# EAGLE design pcb-jetson (EAGLE 9.6.2)
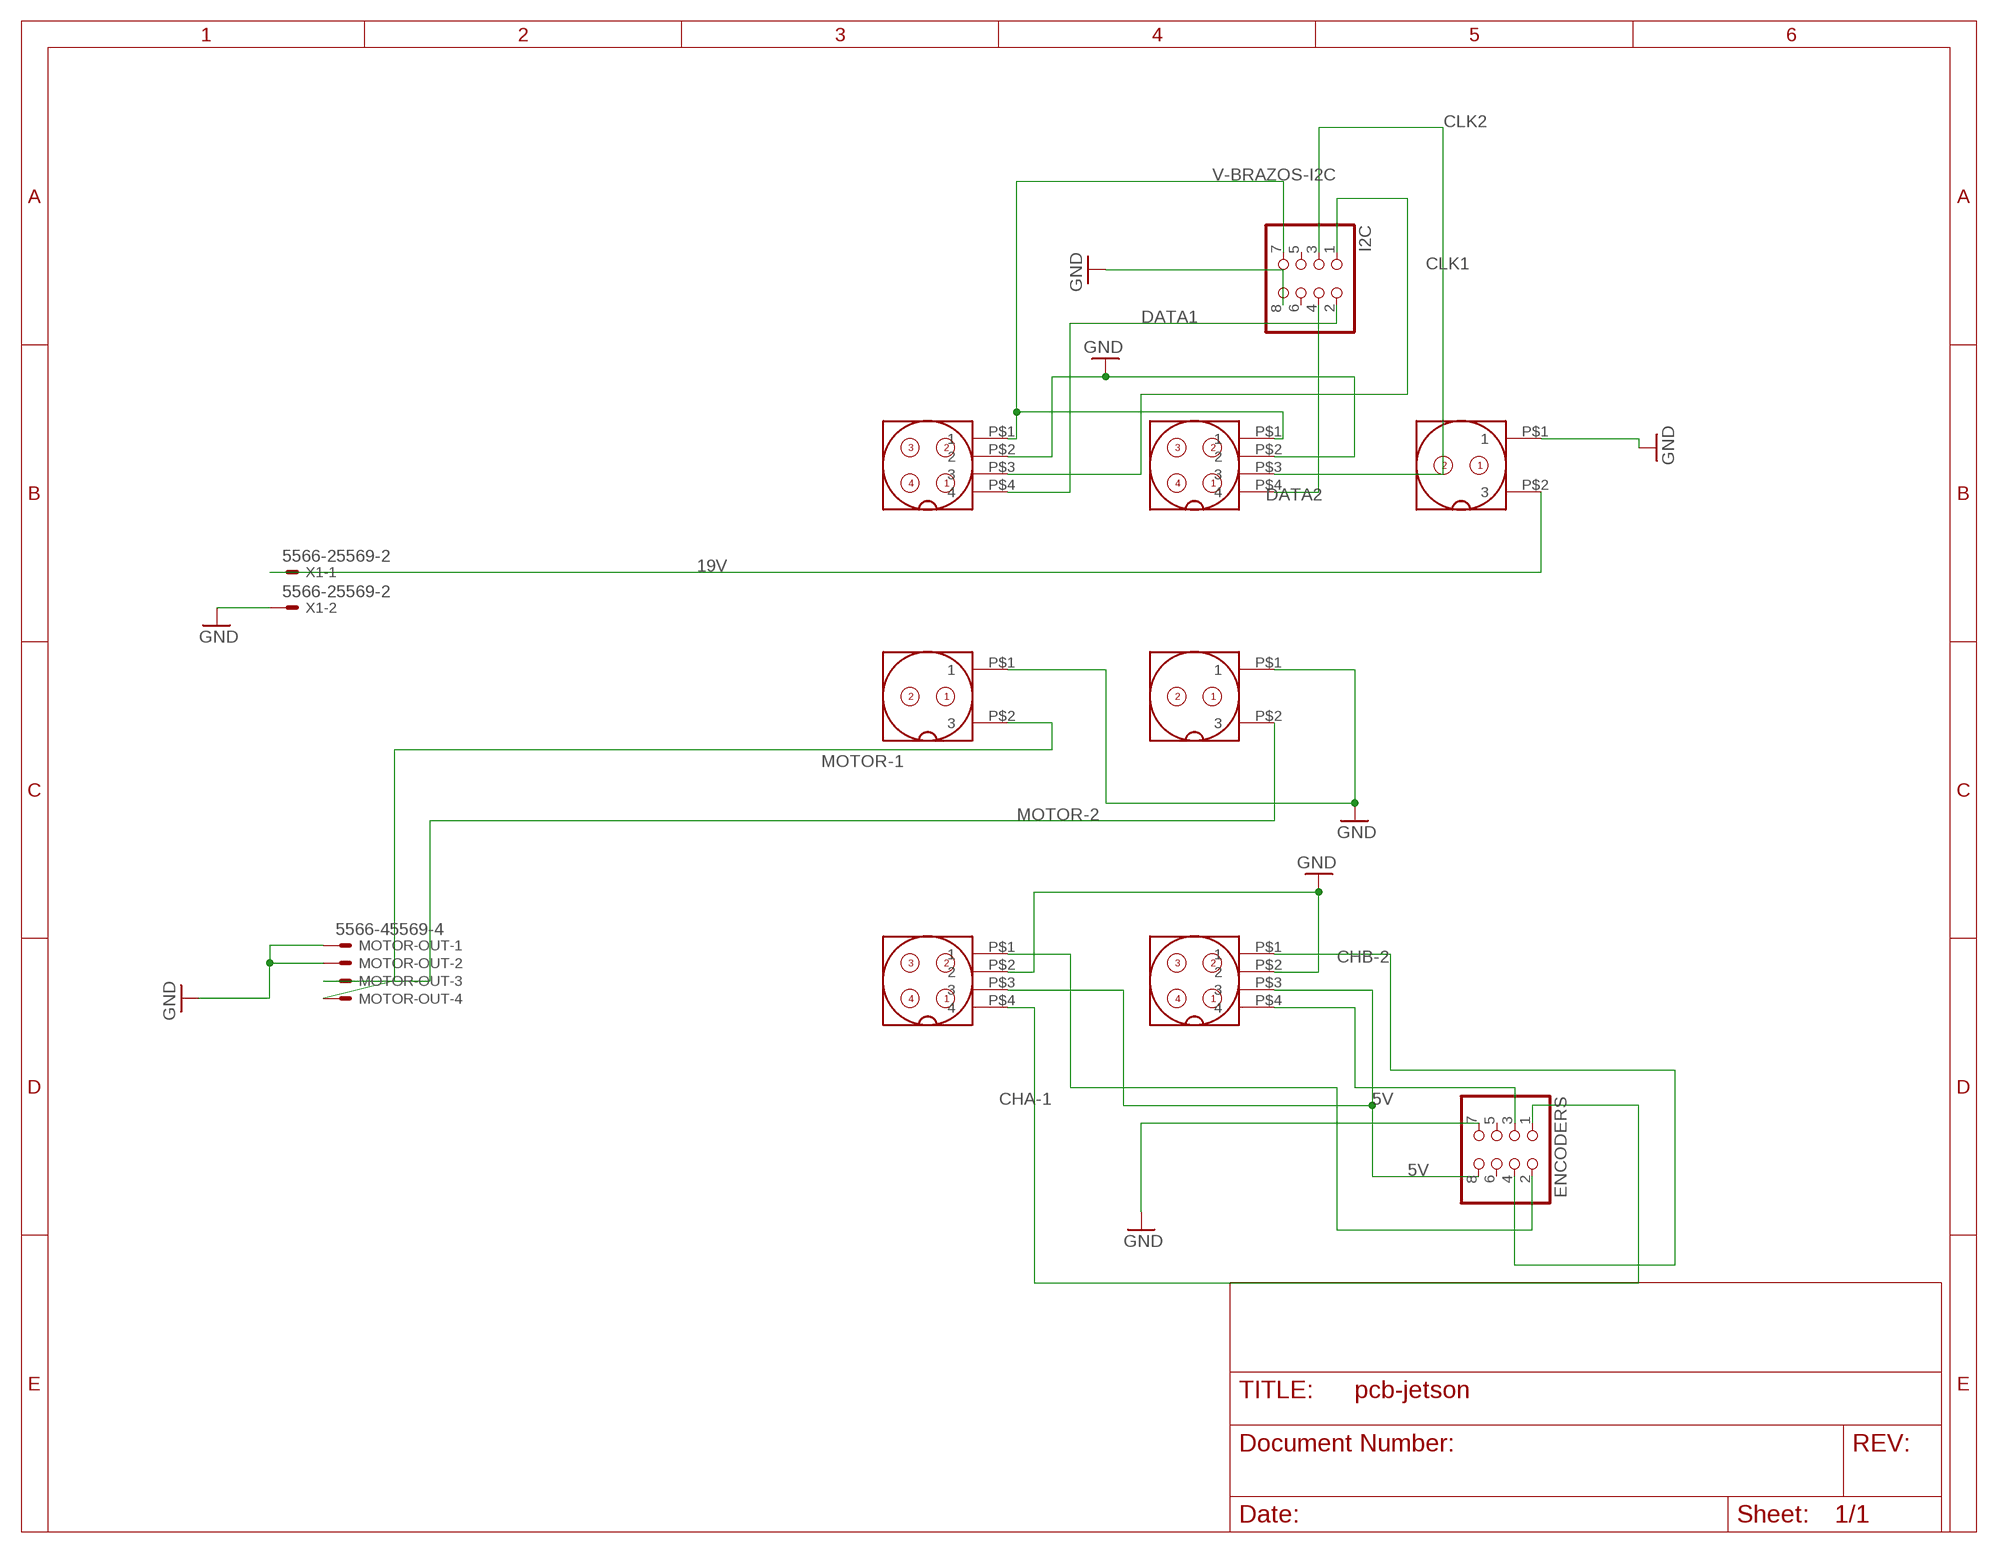
[diagram p0: schematic, sheet 1]

## Parts
BRAZO-I2C-2  GX16_4_PINS  [GX16_4_PINS_PADS]
BRAZO_I2C-1  GX16_4_PINS  [GX16_4_PINS_PADS]
ENCODERS  PINHD-2X4  [2X04]
I2C  PINHD-2X4  [2X04]
JETSONIN  GX16_2_PINS  [GX16_2_PINS_PADS]
MOTOR1  GX16_2_PINS  [GX16_2_PINS_PADS]
MOTOR2  GX16_2_PINS  [GX16_2_PINS_PADS]
MOTOR-OUT  5566-45569-4  [5569-4]
U$3  GX16_4_PINS  [GX16_4_PINS_PADS]
U$4  GX16_4_PINS  [GX16_4_PINS_PADS]
X1  5566-25569-2  [5569-2]

## Nets
5V: ENCODERS.8 U$3.P$3 U$4.P$3
19V: JETSONIN.P$2 X1.1
CHA-1: ENCODERS.1 U$3.P$4
CHA-2: ENCODERS.3 U$4.P$4
CHB-1: ENCODERS.2 U$3.P$1
CHB-2: ENCODERS.4 U$4.P$1
CLK1: BRAZO_I2C-1.P$3 I2C.1
CLK2: BRAZO-I2C-2.P$3 I2C.3
DATA1: BRAZO_I2C-1.P$4 I2C.2
DATA2: BRAZO-I2C-2.P$4 I2C.4
GND: BRAZO-I2C-2.P$2 BRAZO_I2C-1.P$2 ENCODERS.7 I2C.8 JETSONIN.P$1 MOTOR1.P$1 MOTOR2.P$1 MOTOR-OUT.1 MOTOR-OUT.2 U$3.P$2 U$4.P$2 X1.2
MOTOR-1: MOTOR1.P$2 MOTOR-OUT.4
MOTOR-2: MOTOR2.P$2 MOTOR-OUT.3
V-BRAZOS-I2C: BRAZO-I2C-2.P$1 BRAZO_I2C-1.P$1 I2C.7
Unconnected: ENCODERS.5 ENCODERS.6 I2C.5 I2C.6

## Library data of the parts
BRAZO-I2C-2 BRAZO_I2C-1 U$3 U$4 = Robocol_Eagle_Libraries:GX16_4_PINS: GX19 Reference: GX19 4 pins Type: Male Connector. Description: Aviation connector use for power connections. Rated Current: 7A Maximum working Voltage: 250 V AC RMS Author: Franz Luepke. Year: 2020 Made for use in: Robocol Uniandes.
ENCODERS I2C = pinhead:PINHD-2X4: PIN HEADER
JETSONIN MOTOR1 MOTOR2 = Robocol_Eagle_Libraries:GX16_2_PINS: GX19 Reference: GX19 2 pins Type: Male Connector. Description: Aviation connector use for power connections. Rated Current: 7A Maximum working Voltage: 250 V AC RMS Author: Franz Luepke. Year: 2020 Made for use in: Robocol Uniandes.
MOTOR-OUT = con-molex-2:5566-4: Mini FIT connector 4 pol Source: http://www.molex.com
X1 = con-molex-2:5566-2: Mini FIT connector 2 pol Source: http://www.molex.com

## Board
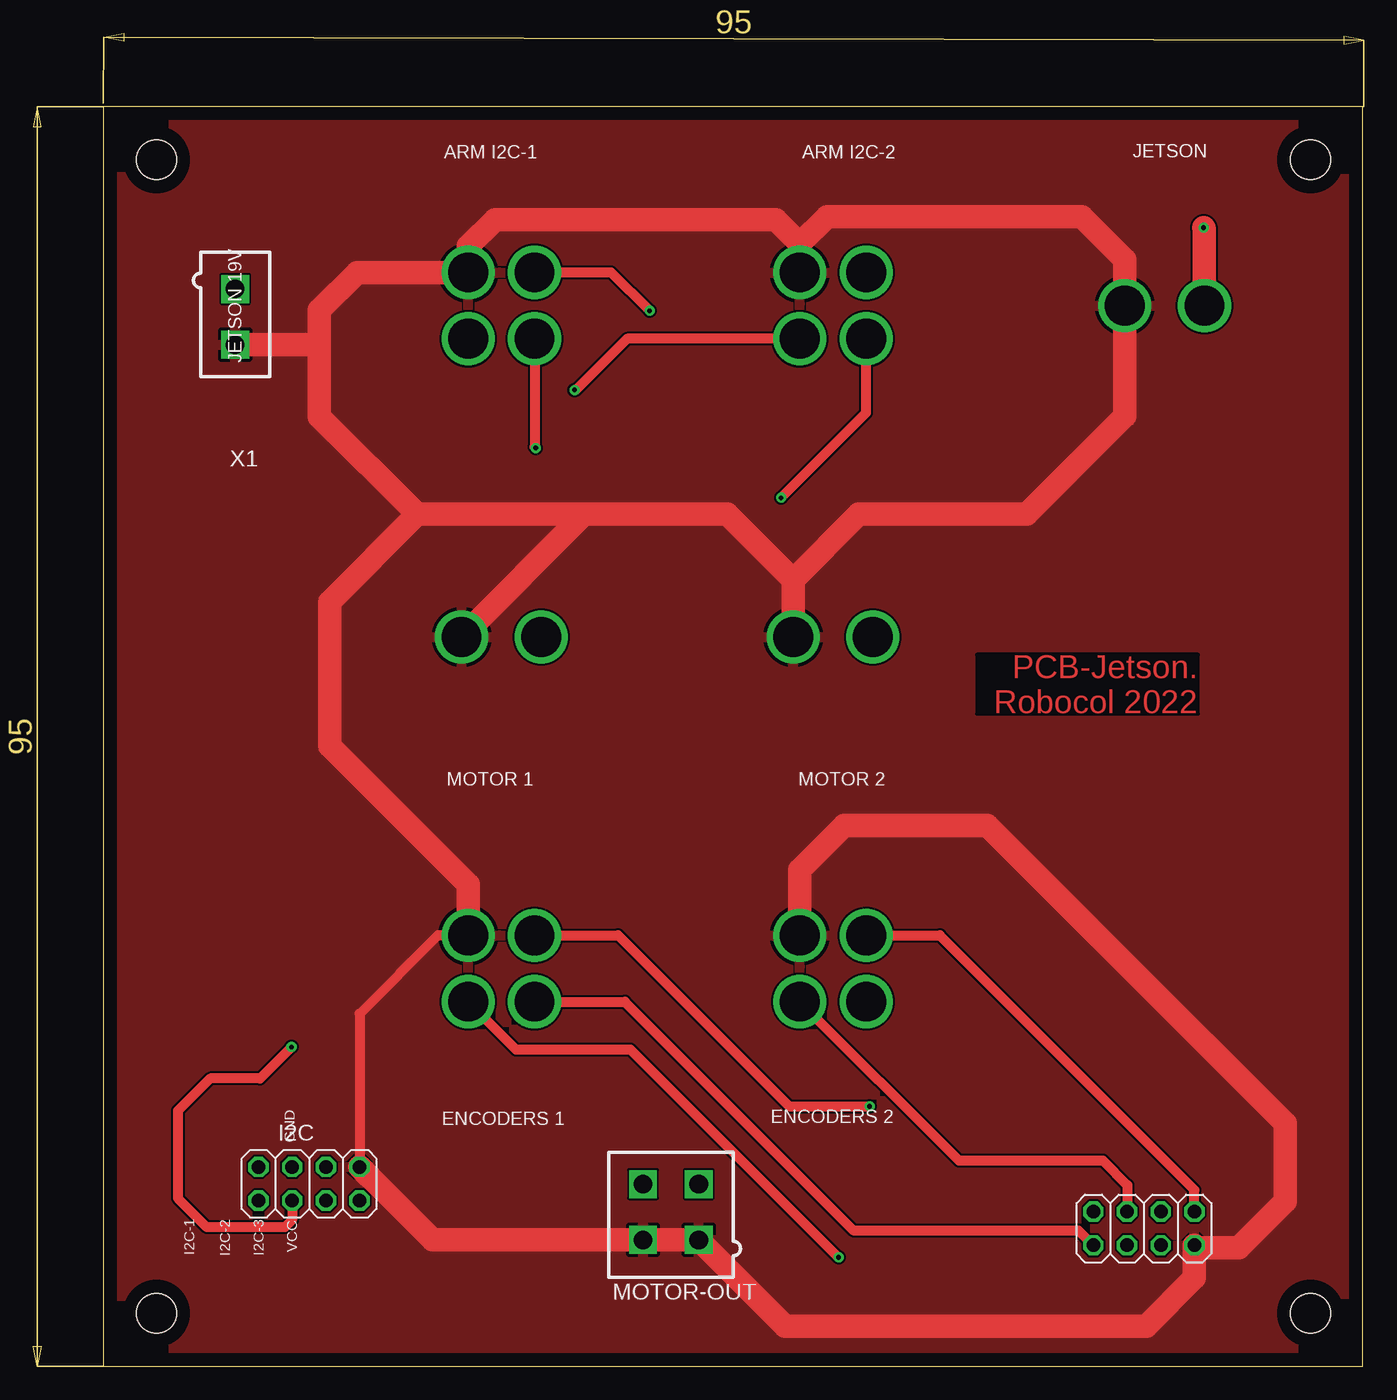
[diagram p1: board, top side]
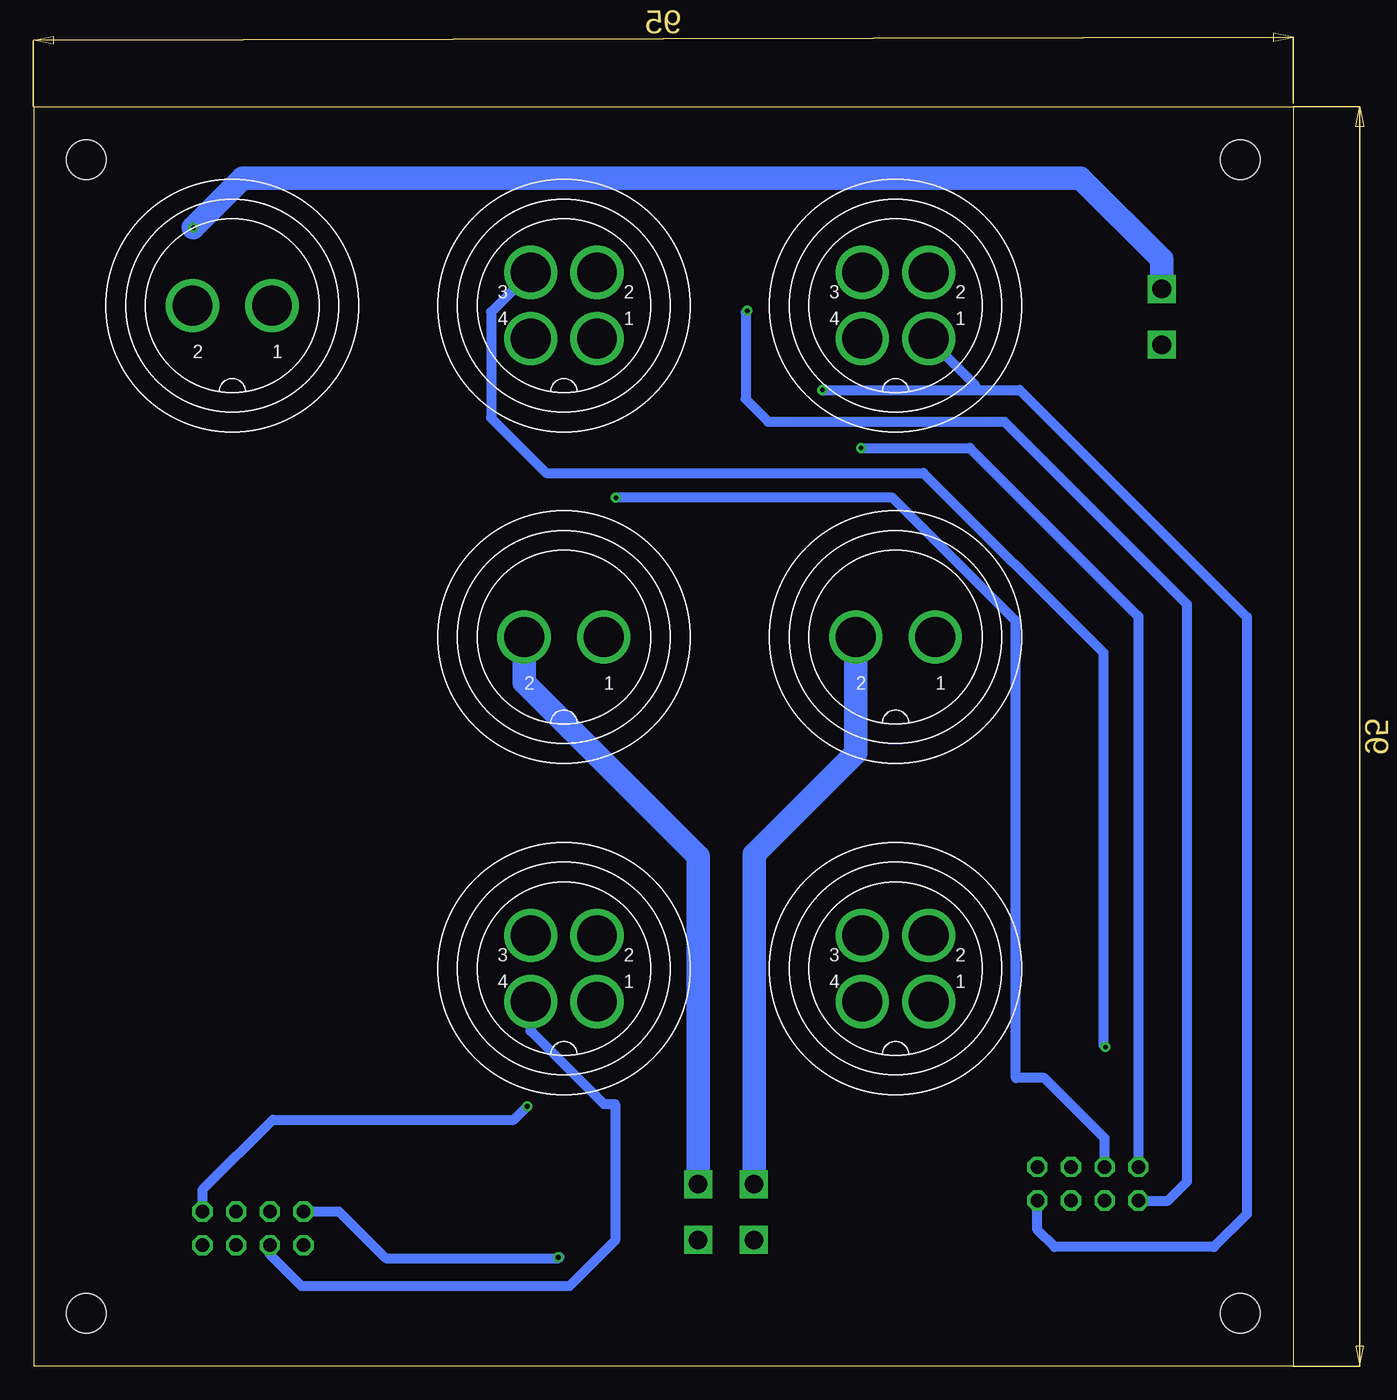
[diagram p2: board, bottom side, seen from below]

Size 94.93 x 95 mm. Coordinates in mm from the lower left corner, seen from the top.
Outline: 0,0 94.93,0 94.93,95 0,95 0,0
Copper layers (1*16): Top 0.035mm / dielectric 1.5mm / Bottom 0.035mm
Design rules "default": minimum track width 6mil, minimum drill 0.35mm, track to track 6mil, track to pad 6mil, pad to pad 6mil, via to via 6mil, smd to smd 6mil, copper to edge 40mil, drill to drill 6mil, minimum pad ring 10mil, minimum via ring 8mil, stop-mask expansion 4mil, vias tented up to drill 0mil, thermal gap 10mil
Holes 3 mm at 4,91 91,91 91,4 4,4

### Footprints (pad centres in the part's own frame; a part is rotated, then mirrored left to right if it is on the bottom)
GX16_4_PINS_PADS = drill 3 pad 4: P$1 2.5,-2.5; P$2 2.5,2.5; P$3 -2.5,2.5; P$4 -2.5,-2.5
2X04 = drill 1.016 octagon: 1 -3.81,-1.27; 2 -3.81,1.27; 3 -1.27,-1.27; 4 -1.27,1.27; 5 1.27,-1.27; 6 1.27,1.27; 7 3.81,-1.27; 8 3.81,1.27
GX16_2_PINS_PADS = drill 3 pad 4: P$1 3,0; P$2 -3,0
5569-4 = drill 1.4 square: 1 2.1,-2.1; 2 -2.1,-2.1; 3 2.1,2.1; 4 -2.1,2.1
5569-2 = drill 1.4 square: 1 0,-2.1; 2 0,2.1

### Placement (x,y rotation side)
BRAZO-I2C-2  55,80 0 bottom
BRAZO_I2C-1  30,80 0 bottom
ENCODERS  78.44,10.4 0 top
I2C  15.5,13.77 0 top
JETSONIN  80,80 0 bottom
MOTOR1  30,55 0 bottom
MOTOR2  55,55 0 bottom
MOTOR-OUT  42.78,11.63 0 top
U$3  30,30 0 bottom
U$4  55,30 0 bottom
X1  9.93,79.15 180 top

### Tracks (layer width: path | path; a pad name or v marks a point on that pad's centre or on a via)
5V  (via drill 0.35)
  Top 0.762: U$3.P$3 38.8,32.5 51.69,19.61 v57.76,19.61 | U$4.P$3 63.06,32.5 82.25,13.31 ENCODERS.8
  Bottom 0.762: ENCODERS.8 82.25,13.31 76.95,18.61 58.76,18.61 v57.76,19.61
19V  (via drill 0.35)
  Top 1.778: v82.94,85.88 83,85.81 JETSONIN.P$2
  Bottom 1.778: v82.94,85.88 79.2,89.61 16.06,89.61 9.93,83.49 X1.1
CHA-1
  Top 0.762: U$3.P$4 39.31,27.5 56.57,10.24 73.52,10.24 ENCODERS.1
CHA-2
  Bottom 0.762: U$4.P$4 57.5,25.29 51.97,19.76 51.13,19.76 51.13,9.5 54.59,6.04 74.77,6.04 77.17,8.44 ENCODERS.3
CHB-1  (via drill 0.35)
  Top 0.762: U$3.P$1 31.1,23.9 39.73,23.9 55.4,8.23 v55.43,8.23
  Bottom 0.762: v55.43,8.23 55.33,8.23 55.4,8.15 68.43,8.15 71.95,11.67 ENCODERS.2
CHB-2
  Top 0.762: U$4.P$1 64.48,15.52 75.34,15.52 77.19,13.66 77.19,11.69 ENCODERS.4
CLK1  (via drill 0.35)
  Top 0.762: v41.18,79.6 38.28,82.5 BRAZO_I2C-1.P$3
  Bottom 0.762: I2C.1 9.46,12.5 8.02,13.95 8.02,57.47 21.8,71.25 39.6,71.25 41.3,72.95 41.3,79.48 v41.18,79.6
CLK2  (via drill 0.35)
  Top 0.762: v14.18,24.08 11.81,21.72 8.06,21.72 5.62,19.28 5.62,12.68 7.8,10.49 13.67,10.49 14.23,11.05 I2C.3
  Bottom 0.762: BRAZO-I2C-2.P$3 60.48,79.52 60.48,71.53 56.34,67.39 27.89,67.39 14.33,53.82 14.33,24.23 v14.18,24.08
DATA1  (via drill 0.35)
  Top 0.762: v32.59,69.27 32.5,69.36 BRAZO_I2C-1.P$4
  Bottom 0.762: v32.59,69.27 24.39,69.27 11.69,56.57 I2C.2
DATA2  (via drill 0.35)
  Top 0.762: v51.08,65.51 57.5,71.92 BRAZO-I2C-2.P$4
  Bottom 0.762: v51.08,65.51 30.23,65.51 20.93,56.21 20.93,21.74 18.77,21.74 14.23,17.2 I2C.4
GND
  Top 0.762: 27.5,36.35 27.5,36.84 | BRAZO_I2C-1.P$2 27.5,84.47 | U$3.P$2 25.21,32.5 19.31,26.6 I2C.8
  Top 1.778: MOTOR1.P$1 36.26,64.26 | 36.26,64.26 47.05,64.26 52,59.31 | MOTOR2.P$1 52,59.31 | 52,59.31 56.95,64.26 69.6,64.26 77,71.66 JETSONIN.P$1 77,83.48 73.77,86.72 54.55,86.72 52.5,84.66 | 23.65,64.26 36.26,64.26 | U$3.P$2 27.5,36.35 17.05,46.8 17.05,57.66 23.65,64.26 | U$4.P$2 52.5,37.45 55.85,40.79 66.63,40.79 89.11,18.31 89.11,12.45 85.6,8.94 82.44,8.94 ENCODERS.7 82.25,6.66 78.61,3.02 51.39,3.02 MOTOR-OUT.1 MOTOR-OUT.2 24.83,9.53 20.06,14.3 20.05,14.3 I2C.8 | BRAZO_I2C-1.P$2 19.13,82.5 16.29,79.65 16.29,76.96 | 16.29,76.96 16.29,71.63 23.65,64.26 | 27.5,84.47 29.52,86.49 50.68,86.49 52.5,84.66 | BRAZO-I2C-2.P$2 52.5,84.66 | X1.2 16.2,77.05 16.29,76.96
  pour Top: 0,95.25 0,0 95.33,0 95.33,95.25
MOTOR-1
  Bottom 1.778: MOTOR-OUT.4 40.65,13.76 40.65,38.6 33,46.25 MOTOR1.P$2
MOTOR-2
  Top 1.778: MOTOR2.P$2
  Bottom 1.778: MOTOR-OUT.3 44.88,38.45 58,51.57 MOTOR2.P$2
V-BRAZOS-I2C  (via drill 0.35)
  Top 0.762: v35.51,73.64 35.62,73.64 39.48,77.5 BRAZO-I2C-2.P$1
  Bottom 0.762: 35.36,73.69 35.46,73.58 v35.51,73.64 24,73.64 | 24,73.64 20.64,73.64 3.52,56.52 3.52,11.48 6,9 18,9 19.31,10.31 I2C.7 | BRAZO_I2C-1.P$1 24,74 24,73.64

### Text on the board
Top: PCB-Jetson. / Robocol 2022
tNames: ARM I2C-1 | ARM I2C-2 | JETSON | JETSON 19V | MOTOR 1 | MOTOR 2 | ENCODERS 1 | ENCODERS 2 | GND | VCC | I2C-1 | I2C-2 | I2C-3